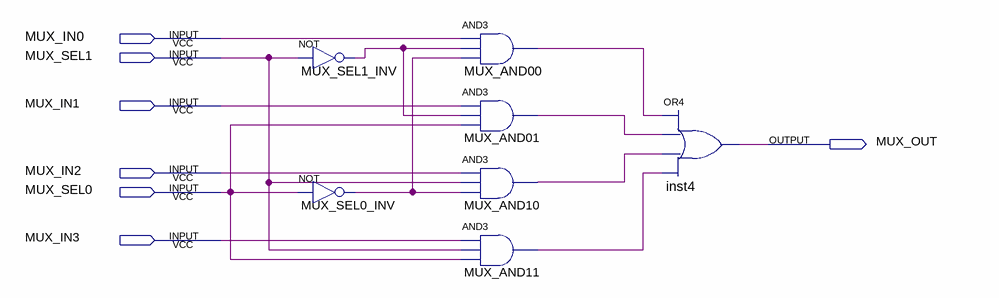
[diagram p0: schematic sheet]
// Quartus schematic mux41.bdf as structural Verilog: 7 symbols, 7 pins
module mux41 (
  input  MUX_IN0,
  input  MUX_SEL1,
  input  MUX_IN1,
  input  MUX_IN2,
  input  MUX_SEL0,
  input  MUX_IN3,
  output MUX_OUT
);

  wire MUX_AND00_out, MUX_AND01_out, MUX_AND10_out, MUX_AND11_out, MUX_SEL0_INV_out, MUX_SEL1_INV_out;

  not MUX_SEL1_INV (MUX_SEL1_INV_out, MUX_SEL1);
  not MUX_SEL0_INV (MUX_SEL0_INV_out, MUX_SEL0);
  and MUX_AND00 (MUX_AND00_out, MUX_IN0, MUX_SEL1_INV_out, MUX_SEL0_INV_out);
  and MUX_AND01 (MUX_AND01_out, MUX_IN1, MUX_SEL1_INV_out, MUX_SEL0);
  and MUX_AND10 (MUX_AND10_out, MUX_IN2, MUX_SEL1, MUX_SEL0_INV_out);
  and MUX_AND11 (MUX_AND11_out, MUX_IN3, MUX_SEL1, MUX_SEL0);
  or inst4 (MUX_OUT, MUX_AND00_out, MUX_AND01_out, MUX_AND10_out, MUX_AND11_out);
endmodule
